# Altium schematic sheet 参考电路图.SchDoc
size 431 x 279 mm; Date: Not shown in title block; ApprovedBy: Not shown in title block; CheckedBy: Not shown in title block; Author: Not shown in title block; CompanyName: Not shown in title block; Engineer: Not shown in title block; Organization: Not shown in title block; Address1: Not shown in title block; Address2: Not shown in title block; Address3: Not shown in title block; Address4: Not shown in title block; DocumentNumber: 1; Revision: Use project parameter SCH_Rev; SheetNumber: 1; SheetTotal: 1; PageSetup: Record=PageOptions|CenterHorizontal=True|CenterVertical=True|PrintScale=0.64|XCorrection=1.00|YCorrection=1.00|PrintKind=0|BorderSize=5000000|LeftOffset=0|BottomOffset=0|Orientation=2|PaperLength=1000|PaperWidth=1000|Scale=100|PaperSource=15|PrintQuality=600|MediaType=1|DitherType=10|PaperKind=Letter|PrintScaleMode=1; CurrentTime: Not shown in title block; CurrentDate: Not shown in title block; Time: Not shown in title block; DocumentFullPathAndName: Not shown in title block; DocumentName: Not shown in title block; ModifiedDate: Not shown in title block; ImagePath: Not shown in title block
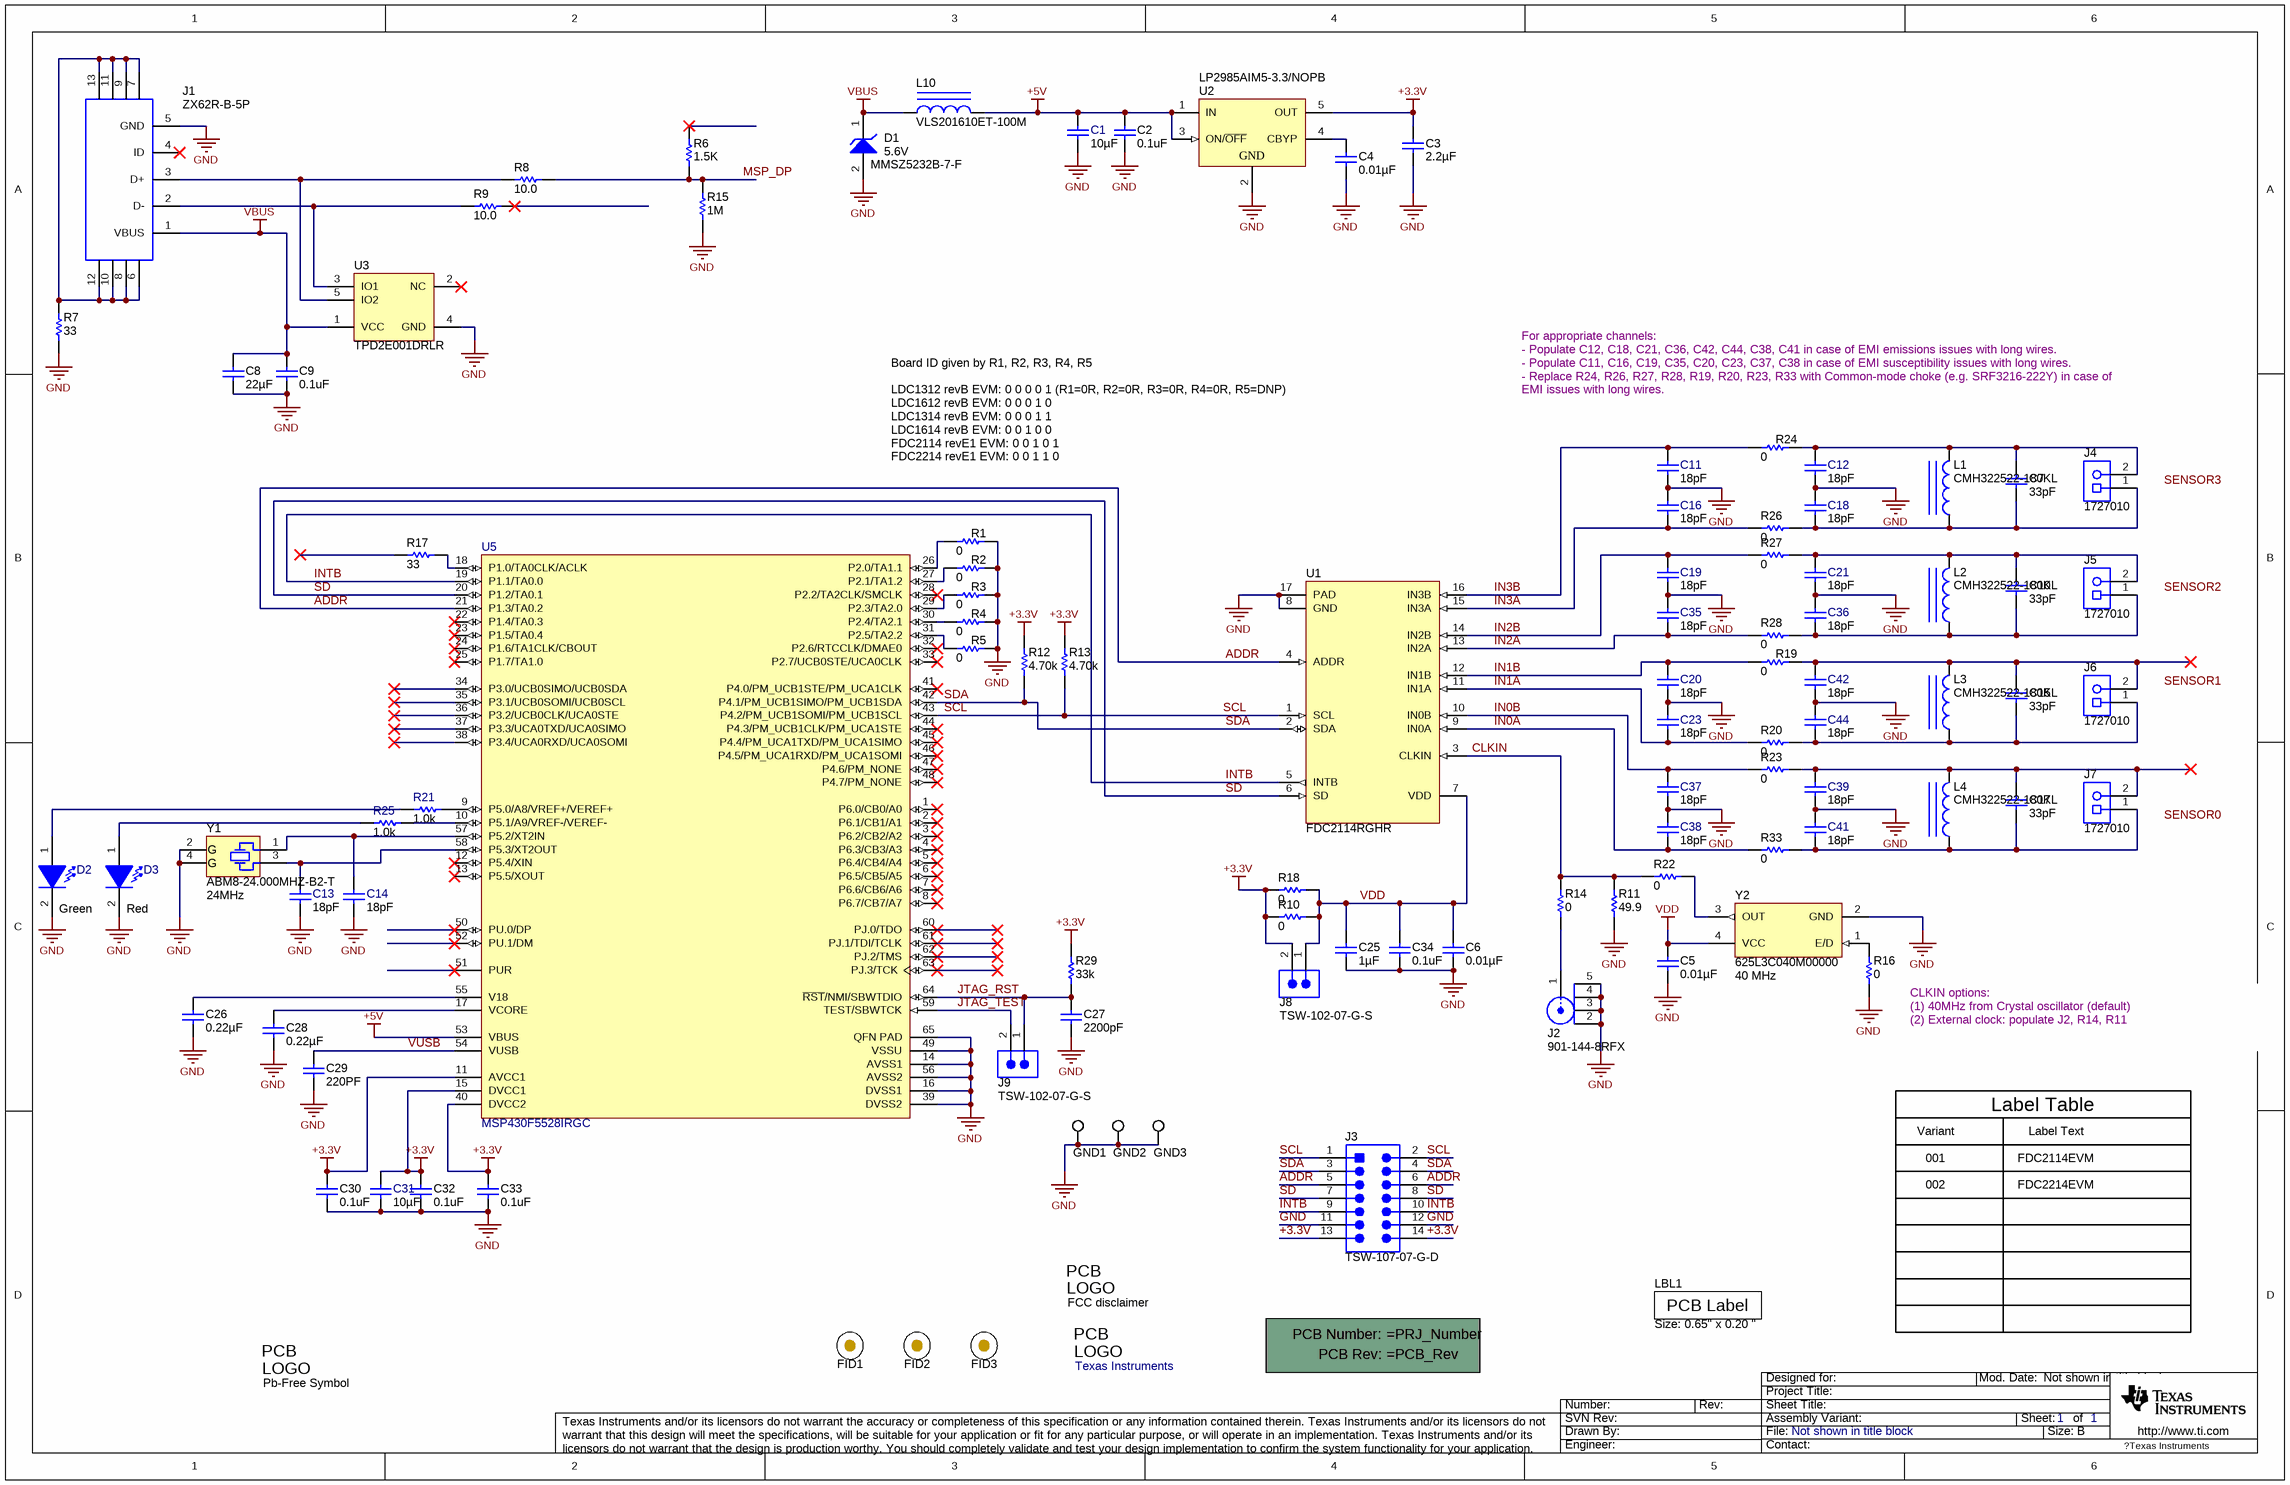
[diagram p0: 参考电路图.SchDoc]

## Parts
!PCB1  Printed Circuit Board  (value not drawn)  (mechanical)
C1  ValueDisplayed: 10µF  [0603]  (hidden comment: C1608X5R1A106M)
C2  value 0.1uF  [0402]  (hidden comment: GRM155R71C104JA88D)
C3  ValueDisplayed: 2.2µF  [0603]  (hidden comment: C0603C225K8PACTU)
C4  ValueDisplayed: 0.01µF  [0603]  (hidden comment: C1608C0G1E103J)
C5  ValueDisplayed: 0.01µF  [0603]  (hidden comment: C1608C0G1E103J)
C6  ValueDisplayed: 0.01µF  [0402]  (hidden comment: C1005X7R1C103K)
C7  ValueDisplayed: 33pF  [0603_950]  (hidden comment: CL10C330FB8NNNC)
C8  ValueDisplayed: 22µF  [0805_HV]  (hidden comment: C2012X5R1C226K125AC)
C9  value 0.1uF  [0402]  (hidden comment: GRM155R71C104JA88D)
C10  ValueDisplayed: 33pF  [0603_950]  (hidden comment: CL10C330FB8NNNC)
C11  ValueDisplayed: 18pF  [0603]  (hidden comment: GRM1885C2A180JA01D)
C12  ValueDisplayed: 18pF  [0603]  (hidden comment: GRM1885C2A180JA01D)
C13  ValueDisplayed: 18pF  [0603]  (hidden comment: GRM1885C2A180JA01D)
C14  ValueDisplayed: 18pF  [0603]  (hidden comment: GRM1885C2A180JA01D)
C15  ValueDisplayed: 33pF  [0603_950]  (hidden comment: CL10C330FB8NNNC)
C16  ValueDisplayed: 18pF  [0603]  (hidden comment: GRM1885C2A180JA01D)
C17  ValueDisplayed: 33pF  [0603_950]  (hidden comment: CL10C330FB8NNNC)
C18  ValueDisplayed: 18pF  [0603]  (hidden comment: GRM1885C2A180JA01D)
C19  ValueDisplayed: 18pF  [0603]  (hidden comment: GRM1885C2A180JA01D)
C20  ValueDisplayed: 18pF  [0603]  (hidden comment: GRM1885C2A180JA01D)
C21  ValueDisplayed: 18pF  [0603]  (hidden comment: GRM1885C2A180JA01D)
C23  ValueDisplayed: 18pF  [0603]  (hidden comment: GRM1885C2A180JA01D)
C25  ValueDisplayed: 1µF  [0402]  (hidden comment: GRM155R61A105KE15D)
C26  ValueDisplayed: 0.22µF  [0805_HV]  (hidden comment: 08053C224JAT2A)
C27  ValueDisplayed: 2200pF  [0603]  (hidden comment: C0603X222K5RACTU)
C28  ValueDisplayed: 0.22µF  [0805_HV]  (hidden comment: 08053C224JAT2A)
C29  value 220PF  [0402]  (hidden comment: C1005C0G1H221F050BA)
C30  value 0.1uF  [0402]  (hidden comment: GRM155R71C104JA88D)
C31  ValueDisplayed: 10µF  [0603]  (hidden comment: C1608X5R1A106M)
C32  value 0.1uF  [0402]  (hidden comment: GRM155R71C104JA88D)
C33  value 0.1uF  [0402]  (hidden comment: GRM155R71C104JA88D)
C34  value 0.1uF  [0402]  (hidden comment: GRM155R71C104JA88D)
C35  ValueDisplayed: 18pF  [0603]  (hidden comment: GRM1885C2A180JA01D)
C36  ValueDisplayed: 18pF  [0603]  (hidden comment: GRM1885C2A180JA01D)
C37  ValueDisplayed: 18pF  [0603]  (hidden comment: GRM1885C2A180JA01D)
C38  ValueDisplayed: 18pF  [0603]  (hidden comment: GRM1885C2A180JA01D)
C39  ValueDisplayed: 18pF  [0603]  (hidden comment: GRM1885C2A180JA01D)
C41  ValueDisplayed: 18pF  [0603]  (hidden comment: GRM1885C2A180JA01D)
C42  ValueDisplayed: 18pF  [0603]  (hidden comment: GRM1885C2A180JA01D)
C44  ValueDisplayed: 18pF  [0603]  (hidden comment: GRM1885C2A180JA01D)
D1  MMSZ5232B-7-F  value 5.6V  [SOD-123]
D2  value Green  [LG L29K_GREEN]  (hidden comment: LG L29K-G2J1-24-Z)
D3  value Red  [SML-LX0603SRW_SuperRed]  (hidden comment: SML-LX0603SRW-TR)
FID1  Fiducial  [Fiducial10-20]  (value not drawn)
FID2  Fiducial  [Fiducial10-20]  (value not drawn)
FID3  Fiducial  [Fiducial10-20]  (value not drawn)
GND1  5015  [Testpoint_Keystone_Miniature]  (value not drawn)
GND2  5015  [Testpoint_Keystone_Miniature]  (value not drawn)
GND3  5015  [Testpoint_Keystone_Miniature]  (value not drawn)
J1  ZX62R-B-5P  [Hirose_ZX62R-B-5P]
J2  901-144-8RFX  [Amphenol_901-144-8RFX]
J3  TSW-107-07-G-D  [TSW-107-07-G-D]
J4  1727010  [PhoenixConact_1727010]
J5  1727010  [PhoenixConact_1727010]
J6  1727010  [PhoenixConact_1727010]
J7  1727010  [PhoenixConact_1727010]
J8  TSW-102-07-G-S  [TSW-102-07-G-S]
J9  TSW-102-07-G-S  [TSW-102-07-G-S]
L1  CMH322522-180KL  [CMH322522]
L2  CMH322522-180KL  [CMH322522]
L3  CMH322522-180KL  [CMH322522]
L4  CMH322522-180KL  [CMH322522]
L10  VLS201610ET-100M  [VLS201610ET]
LBL1  Size: 0.65" x 0.20 "  [Label_650x200]
Logo1  Texas Instruments  [TI_Stacked_Overlay_Small]  (no BOM)
Logo2  FCC disclaimer  [FCC_disclaimer_stacked]  (no BOM)
Logo3  Pb-Free Symbol  [Pb-Free_Overlay_Medium]  (no BOM)
R1  value 0  [0603]  (hidden comment: CRCW06030000Z0EA)
R2  value 0  [0603]  (hidden comment: CRCW06030000Z0EA)
R3  value 0  [0603]  (hidden comment: CRCW06030000Z0EA)
R4  value 0  [0603]  (hidden comment: CRCW06030000Z0EA)
R5  value 0  [0603]  (hidden comment: CRCW06030000Z0EA)
R6  value 1.5K  [0402]  (hidden comment: CRCW04021K50JNED)
R7  value 33  [0603]  (hidden comment: CRCW060333R0JNEA)
R8  ValueDisplayed: 10.0  [0402]  (hidden comment: CRCW040210R0FKED)
R9  ValueDisplayed: 10.0  [0402]  (hidden comment: CRCW040210R0FKED)
R10  value 0  [0603]  (hidden comment: CRCW06030000Z0EA)
R11  ValueDisplayed: 49.9  [0603]  (hidden comment: CRCW060349R9FKEA)
R12  value 4.70k  [0603]  (hidden comment: RC0603FR-074K7L)
R13  value 4.70k  [0603]  (hidden comment: RC0603FR-074K7L)
R14  value 0  [0603]  (hidden comment: CRCW06030000Z0EA)
R15  value 1M  [0402]  (hidden comment: RC0402JR-071ML)
R16  value 0  [0603]  (hidden comment: CRCW06030000Z0EA)
R17  value 33  [0603]  (hidden comment: CRCW060333R0JNEA)
R18  value 0  [0603]  (hidden comment: CRCW06030000Z0EA)
R19  value 0  [0805_HV]  (hidden comment: CRCW08050000Z0EA)
R20  value 0  [0805_HV]  (hidden comment: CRCW08050000Z0EA)
R21  value 1.0k  [0402]  (hidden comment: CRCW04021K00JNED)
R22  value 0  [0603]  (hidden comment: CRCW06030000Z0EA)
R23  value 0  [0805_HV]  (hidden comment: CRCW08050000Z0EA)
R24  value 0  [0805_HV]  (hidden comment: CRCW08050000Z0EA)
R25  value 1.0k  [0402]  (hidden comment: CRCW04021K00JNED)
R26  value 0  [0805_HV]  (hidden comment: CRCW08050000Z0EA)
R27  value 0  [0805_HV]  (hidden comment: CRCW08050000Z0EA)
R28  value 0  [0805_HV]  (hidden comment: CRCW08050000Z0EA)
R29  value 33k  [0402]  (hidden comment: CRCW040233K0JNED)
R33  value 0  [0805_HV]  (hidden comment: CRCW08050000Z0EA)
U1  FDC2114RGHR  [RGH0016A]
U2  LP2985AIM5-3.3/NOPB  [MF05A_N]
U3  TPD2E001DRLR  [DRL0005A]
U5  MSP430F5528IRGC  [RGC0064B]
Y1  ABM8-24.000MHZ-B2-T  Frequency: 24MHz  [XTAL_ABM8]
Y2  625L3C040M00000  Frequency: 40 MHz  [OSC_CTS_625]

## Nets
+3.3V: C3.1 C30.1 C31.1 C32.1 C33.1 J3.13 J3.14 J8.2 R10.1 R12.2 R13.2 R18.1 R29.1 U2.5(OUT) U5.11(AVCC1) U5.15(DVCC1) U5.40(DVCC2)
+5V: C1.1 C2.1 L10.2 U2.1(IN) U2.3(ON/~{OFF}) U5.53(VBUS)
GND: C1.2 C2.2 C3.2 C4.2 C5.2 C6.2 C8.2 C9.2 C11.1 C12.1 C13.1 C14.1 C16.2 C18.2 C19.1 C20.1 C21.1 C23.2 C25.2 C26.2 C27.1 C28.2 C29.2 C30.2 C31.2 C32.2 C33.2 C34.2 C35.2 C36.2 C37.1 C38.2 C39.1 C41.2 C42.1 C44.2 D1.2(A) D2.2(K) D3.2(K) GND1.1 GND2.1 GND3.1 J1.5(GND) J2.2 J2.3 J2.4 J2.5 J3.11 J3.12 R1.2 R2.2 R3.2 R4.2 R5.2 R7.1 R11.1 R15.1 R16.1 U1.8(GND) U1.17(PAD) U2.2(GND) U3.4(GND) U5.14(AVSS1) U5.16(DVSS1) U5.39(DVSS2) U5.49(VSSU) U5.56(AVSS2) U5.65(QFN_PAD) Y1.2(GND) Y1.4(GND) Y2.2(GND)
VBUS: C8.1 C9.1 D1.1(K) J1.1(VBUS) L10.1 U3.1(VCC)
VDD: C5.1 C6.1 C25.1 C34.1 J8.1 R10.2 R18.2 U1.7(VDD) Y2.4(VCC)
ADDR: J3.5 J3.6 U1.4(ADDR) U5.21(P1.3/TA0.2)
CLKIN: R11.2 R14.2 R22.2 U1.3(CLKIN)
IN0A: C38.1 R33.1 U1.9(IN0A)
IN0B: C37.2 R23.1 U1.10(IN0B)
IN1A: C23.1 R20.1 U1.11(IN1A)
IN1B: C20.2 R19.1 U1.12(IN1B)
IN2A: C35.1 R28.1 U1.13(IN2A)
IN2B: C19.2 R27.1 U1.14(IN2B)
IN3A: C16.1 R26.1 U1.15(IN3A)
IN3B: C11.2 R24.1 U1.16(IN3B)
INTB: J3.9 J3.10 U1.5(INTB) U5.19(P1.1/TA0.0)
JTAG_RST: C27.2 J9.1 R29.2 U5.64(~{RST}/NMI/SBWTDIO)
JTAG_TEST: J9.2 U5.59(TEST/SBWTCK)
MSP_DP: R6.1 R8.2 R15.2
SCL: J3.1 J3.2 R13.1 U1.1(SCL) U5.43(P4.2/PM_UCB1SOMI/PM_UCB1SCL)
SD: J3.7 J3.8 U1.6(SD) U5.20(P1.2/TA0.1)
SDA: J3.3 J3.4 R12.1 U1.2(SDA) U5.42(P4.1/PM_UCB1SIMO/PM_UCB1SDA)
VUSB: C29.1 U5.54(VUSB)
NetC4_1: C4.1 U2.4(CBYP)
NetC7_1: C7.1 C12.2 J4.2 L1.2 R24.2
NetC7_2: C7.2 C18.1 J4.1 L1.1 R26.2
NetC10_1: C10.1 C21.2 J5.2 L2.2 R27.2
NetC10_2: C10.2 C36.1 J5.1 L2.1 R28.2
NetC13_2: C13.2 U5.58(P5.3/XT2OUT) Y1.3
NetC14_2: C14.2 U5.57(P5.2/XT2IN) Y1.1
NetC15_1: C15.1 C42.2 J6.2 L3.2 R19.2
NetC15_2: C15.2 C44.1 J6.1 L3.1 R20.2
NetC17_1: C17.1 C39.2 J7.2 L4.2 R23.2
NetC17_2: C17.2 C41.1 J7.1 L4.1 R33.2
NetC26_1: C26.1 U5.55(V18)
NetC28_1: C28.1 U5.17(VCORE)
NetD2_1: D2.1(A) R21.2
NetD3_1: D3.1(A) R25.2
NetJ1_2: J1.2(D-) R9.1 U3.3(IO1)
NetJ1_3: J1.3(D+) R8.1 U3.5(IO2)
NetJ1_6: J1.6 J1.7 J1.8 J1.9 J1.10 J1.11 J1.12 J1.13 R7.2
NetJ2_1: J2.1 R14.1
NetR1_1: R1.1 U5.26(P2.0/TA1.1)
NetR2_1: R2.1 U5.27(P2.1/TA1.2)
NetR3_1: R3.1 U5.29(P2.3/TA2.0)
NetR4_1: R4.1 U5.30(P2.4/TA2.1)
NetR5_1: R5.1 U5.31(P2.5/TA2.2)
NetR16_2: R16.2 Y2.1(E/D)
NetR17_1: R17.1 U5.18(P1.0/TA0CLK/ACLK)
NetR21_1: R21.1 U5.9(P5.0/A8/VREF+/VEREF+)
NetR22_1: R22.1 Y2.3(OUT)
NetR25_1: R25.1 U5.10(P5.1/A9/VREF-/VEREF-)

Not connected (* = marked no-connect by the designer): J1 4(ID)*; R6 2*; R9 2*; R17 2*; U3 2(NC)*; U5 1(P6.0/CB0/A0)* 2(P6.1/CB1/A1)* 3(P6.2/CB2/A2)* 4(P6.3/CB3/A3)* 5(P6.4/CB4/A4)* 6(P6.5/CB5/A5)* 7(P6.6/CB6/A6)* 8(P6.7/CB7/A7)* 12(P5.4/XIN)* 13(P5.5/XOUT)* 22(P1.4/TA0.3)* 23(P1.5/TA0.4)* 24(P1.6/TA1CLK/CBOUT)* 25(P1.7/TA1.0)* 28(P2.2/TA2CLK/SMCLK)* 32(P2.6/RTCCLK/DMAE0)* 33(P2.7/UCB0STE/UCA0CLK)* 34(P3.0/UCB0SIMO/UCB0SDA)* 35(P3.1/UCB0SOMI/UCB0SCL)* 36(P3.2/UCB0CLK/UCA0STE)* 37(P3.3/UCA0TXD/UCA0SIMO)* 38(P3.4/UCA0RXD/UCA0SOMI)* 41(P4.0/PM_UCB1STE/PM_UCA1CLK)* 44(P4.3/PM_UCB1CLK/PM_UCA1STE)* 45(P4.4/PM_UCA1TXD/PM_UCA1SIMO)* 46(P4.5/PM_UCA1RXD/PM_UCA1SOMI)* 47(P4.6/PM_NONE)* 48(P4.7/PM_NONE)* 50(PU.0/DP)* 51(PUR)* 52(PU.1/DM)* 60(PJ.0/TDO)* 61(PJ.1/TDI/TCLK)* 62(PJ.2/TMS)* 63(PJ.3/TCK)*

## Notes on the sheet
- For appropriate channels:
  - Populate C12, C18, C21, C36, C42, C44, C38, C41 in case of EMI emissions issues with long wires.
  - Populate C11, C16, C19, C35, C20, C23, C37, C38 in case of EMI susceptibility issues with long wires.
  - Replace R24, R26, R27, R28, R19, R20, R23, R33 with Common-mode choke (e.g. SRF3216-222Y) in case of EMI issues with long wires.
- Board ID given by R1, R2, R3, R4, R5
  LDC1312 revB EVM: 0 0 0 0 1 (R1=0R, R2=0R, R3=0R, R4=0R, R5=DNP)
  LDC1612 revB EVM: 0 0 0 1 0
  LDC1314 revB EVM: 0 0 0 1 1
  LDC1614 revB EVM: 0 0 1 0 0
  FDC2114 revE1 EVM: 0 0 1 0 1
  FDC2214 revE1 EVM: 0 0 1 1 0
- (near R16) CLKIN options:
  (1) 40MHz from Crystal oscillator (default)
  (2) External clock: populate J2, R14, R11
- Label Table
- Variant
- 001
- Label Text
- FDC2114EVM
- 002
- FDC2214EVM
- Labels drawn without touching a wire or pin: SENSOR0, SENSOR1, SENSOR2, SENSOR3
- Drawn By:
- SVN Rev:
- Number:
- Rev:
- Sheet Title:
- File:
- Project Title:
- Designed for:
- Assembly Variant:
- Mod. Date:
- Sheet:
- Size:
- of
- B
- http://www.ti.com
- Texas Instruments and/or its licensors do not warrant the accuracy or completeness of this specification or any information contained therein. Texas Instruments and/or its licensors do not warrant that this design will meet the specifications, will be suitable for your application or fit for any particular purpose, or will operate in an implementation. Texas Instruments and/or its licensors do not warrant that the design is production worthy. You should completely validate and test your design implementation to confirm the system functionality for your application.
- Engineer:
- Contact:
- ?Texas Instruments
- (in symbol ABM8-24.000MHZ-B2-T) G
- (in symbol FCC_disclaimer) PCB; LOGO
- (in symbol Pb-Free) PCB; LOGO
- (in symbol PCB) PCB Number:; PCB Rev:
- (in symbol THT-14-423-10) PCB Label
- (in symbol TI_Logo) PCB; LOGO

## Library data of the parts
!PCB1 = PCB: Manufacturer: Any; SymbolCreator: a0412235; SymbolVersion: 2012-05-30; CompType: PCB; PartNumber: =PRJ_Number; RoHS: O; MountType: N/A; Publisher: Texas Instruments; LatestRevisionDate: 2012-06-27; LatestRevisionNote: Initial Version; Alternate Manufacturer: -; Alternate PartNumber: -
C1 C31 = C1608X5R1A106M: CAP, CERM, 10uF, 10V, +/-20%, X5R, 0603; Manufacturer: TDK; Polarized: N; CompType: Capacitor; U/M: EA; Cap_F: 0.00001; Tolerance_%: 20; ESR_Ohm: 0.0078; Value1: 0.0078 ohm; VDC_V: 10; IRMS_A: 1.85; TaMin_C: -55; TaMax_C: 85; SymbolVersion: 2008-07-09; Value: 10uF; PartNumber: C1608X5R1A106M; PackageReference: 0603; RoHS: Y; Value2: 10V; MountType: SMT; Technology: Ceramic; TempCo: X5R; Cap_Case: 0603; Published: 2008-06-19; Publisher: Texas Instruments; LatestRevisionDate: 2014-03-28; ComponentLink1Description: Datasheet link; ComponentLink1URL: http://www.tdk.com/pdf/general_B11.pdf; Supplier 1: Digi-Key; Supplier Part Number 1: 445-6853-1-ND; Supplier 2: Farnell; Supplier Part Number 2: 1962113
C2 C9 C30 C32-C34 = 0402YC132KAT2A: CAP CER 0.1UF 16V 5% X7R 0402; Manufacturer: Murata Electronics North America; Polarized: N; CompType: Capacitor; U/M: EA; Cap_F: 0.0000000013; Tolerance_%: 10; VDC_V: 16; TaMin_C: -55; TaMax_C: 125; SymbolVersion: 2008-07-09; PartNumber: GRM155R71C104JA88D; PackageReference: 0402; RoHS: Y; MountType: SMT; Technology: Ceramic; TempCo: X7R; Cap_Case: 0402; Published: 2008-06-19; Publisher: Texas Instruments; LatestRevisionDate: 2013-02-06; LatestRevisionNote: Changed publisher; ComponentLink1Description: Datasheet link; ComponentLink1URL: https://www.avx.com/docs/catalogs/cx7r.pdf; Supplier 1: Digi-Key; Supplier Part Number 1: 0402YC132KAT2A-ND
C3 = C0603C225K8PACTU: CAP, CERM, 2.2uF, 10V, +/-10%, X5R, 0603; Manufacturer: Kemet; Polarized: N; CompType: Capacitor; U/M: EA; Cap_F: 0.0000022; Tolerance_%: 10; Value1: Unknown; TaMin_C: -55; TaMax_C: 85; SymbolVersion: 2008-07-09; Value: 2.2uF; PartNumber: C0603C225K8PACTU; PackageReference: 0603; RoHS: Y; VDC_V: 10; Value2: 10V; MountType: SMT; Technology: Ceramic; TempCo: X5R; Cap_Case: 0603; Published: 2008-06-19; Publisher: Texas Instruments; LatestRevisionDate: 2013-02-06; LatestRevisionNote: Changed publisher; ComponentLink1Description: Datasheet link; ComponentLink1URL: http://www.kemet.com/kemet/web/homepage/kechome.nsf/vapubfiles/F3102_Y5V.pdf/$file/F3102_Y5V.pdf; Supplier 1: Digi-Key; Supplier Part Number 1: 399-4911-1-ND; Supplier 2: Mouser; Supplier Part Number 2: 80-C0603C225K8P; Supplier 3: Farnell; Supplier Part Number 3: 1108322
C4 C5 = C1608C0G1E103J: CAP, CERM, 0.01uF, 25V, +/-5%, C0G/NP0, 0603; Manufacturer: TDK; Polarized: N; CompType: Capacitor; U/M: EA; Cap_F: 0.00000001; Tolerance_%: 5; VDC_V: 25; TaMin_C: -55; TaMax_C: 125; SymbolVersion: 2008-07-09; Value: 0.01uF; PartNumber: C1608C0G1E103J; PackageReference: 0603; RoHS: Y; Value1: ?; Value2: 25V; MountType: SMT; Technology: Ceramic; TempCo: C0G/NP0; Cap_Case: 0603; Published: 2008-06-19; Publisher: Texas Instruments; LatestRevisionDate: 2012-08-23; LatestRevisionNote: Changed publisher; ComponentLink1Description: Datasheet link; ComponentLink1URL: http://www.tdk.co.jp/tefe02/e412_c.pdf; Alternate PartNumber: -; Alternate Manufacturer: -; Supplier 1: Digi-Key; Supplier Part Number 1: 445-2664-1-ND; Supplier 2: Arrow; Supplier Part Number 2: C1608C0G1E103J
C6 = C1005X7R1C103K: CAP, CERM, 0.01 µF, 16 V, +/- 10%, X7R, 0402; Manufacturer: TDK; Polarized: N; CompType: Capacitor; Value: 0.01uF; U/M: EA; Cap_F: 0.00000001; Tolerance_%: 10; ESR_ohm: 0.0623; Value1: 0.0623 ohm; VDC_V: 16; Value2: 16V; TaMin_C: -55; TaMax_C: 125; SymbolVersion: 2008-07-09; PartNumber: C1005X7R1C103K; PackageReference: 0402; RoHS: Y; MountType: SMT; Technology: Ceramic; TempCo: X7R; Cap_Case: 0402; Published: 2008-06-19; Publisher: Texas Instruments; LatestRevisionDate: 2015-02-18; ComponentLink1Description: Datasheet link; ComponentLink1URL: http://www.tdk.co.jp/tefe02/e412_c.pdf; Supplier 1: Digi-Key; Supplier Part Number 1: 445-1262-1-ND; Supplier 2: Farnell; Supplier Part Number 2: 1844125
C7 C10 C15 C17 = CL10C330FB8NNNC: CAP, CERM, 33 pF, 50 V, +/- 1%, C0G/NP0, 0603_950; Manufacturer: Samsung; Polarized: N; CompType: Capacitor; Value: 33pF; U/M: EA; Cap_F: 0.000000000033; Tolerance_%: 1; Value1: Unknown; VDC_V: 50; Value2: 50V; TaMin_C: -55; TaMax_C: 125; Cap_Case: 0603; SymbolVersion: 2008-07-09; PartNumber: CL10C330FB8NNNC; PackageReference: 0603_950; RoHS: Y; MountType: SMT; Technology: Ceramic; TempCo: C0G/NP0; Published: 2008-06-19; Publisher: Texas Instruments; LatestRevisionDate: 2015-03-17; ComponentLink1Description: Datasheet link; ComponentLink1URL: http://www.samsungsem.com/kr/front/downloadcms.do?path=/kr/support/product-search/mlcc/__icsFiles/afieldfile/2014/11/05&fileName=S_CL10C330FB8NNNC.pdf; Supplier 1: Digi-Key; Supplier Part Number 1: 1276-2262-1-ND
C8 = C2012X5R1C226K125AC: CAP, CERM, 22uF, 16V, +/-10%, X5R, 0805; Manufacturer: TDK; Polarized: N; CompType: Capacitor; U/M: EA; Cap_F: 0.000022; Tolerance_%: 10; Value1: Unknown; VDC_V: 16; TaMin_C: -55; TaMax_C: 85; Cap_Case: 0805; SymbolVersion: 2008-07-09; Value: 22uF; PartNumber: C2012X5R1C226K125AC; PackageReference: 0805; RoHS: Y; Value2: 16V; MountType: SMT; Technology: Ceramic; TempCo: X5R; Published: 2008-06-19; Publisher: Texas Instruments; LatestRevisionDate: 2014-04-18; ComponentLink1Description: Datasheet link; ComponentLink1URL: http://product.tdk.com/capacitor/mlcc/en/documents/C2012X5R1C226K125AC.pdf; Supplier 1: Digi-Key; Supplier Part Number 1: 445-6797-1-ND; Supplier 2: Mouser; Supplier Part Number 2: 810-C2012X5R1C226K; Supplier 3: Farnell; Supplier Part Number 3: 2346925
C11-C14 C16 C18-C21 C23 C35-C39 C41 C42 C44 = GRM1885C2A180JA01D: CAP, CERM, 18pF, 100V, +/-5%, C0G/NP0, 0603; Manufacturer: MuRata; Polarized: N; CompType: Capacitor; U/M: EA; Cap_F: 0.000000000018; Tolerance_%: 5; Value1: Unknown; VDC_V: 100; TaMin_C: -55; TaMax_C: 125; SymbolVersion: 2008-07-09; Value: 18pF; PartNumber: GRM1885C2A180JA01D; PackageReference: 0603; RoHS: Y; Value2: 100V; MountType: SMT; Technology: Ceramic; TempCo: C0G/NP0; Cap_Case: 0603; Published: 2008-06-19; Publisher: Texas Instruments; LatestRevisionDate: 2014-04-03; ComponentLink1Description: Datasheet link; ComponentLink1URL: http://search.murata.co.jp/Ceramy/PnsearchViewAction.do?HnOFG=ON&HnNFG=ON&SEL_CNT=50&sLang=en&sKey=GRM1885C2A180JA01D&x=9&y=9&search=startwith; Supplier 1: Digi-Key; Supplier Part Number 1: 490-1333-1-ND; Supplier 2: Mouser; Supplier Part Number 2: 81-GRM1885C2A180JA01
C25 = GRM155R61A105KE15D: CAP, CERM, 1uF, 10V, +/-10%, X5R, 0402; Manufacturer: MuRata; Polarized: N; CompType: Capacitor; U/M: EA; Cap_F: 0.000001; Tolerance_%: 10; Value1: Unknown; TaMin_C: -55; TaMax_C: 85; SymbolVersion: 2008-07-09; Value: 1uF; PartNumber: GRM155R61A105KE15D; PackageReference: 0402; RoHS: Y; VDC_V: 10; Value2: 10V; MountType: SMT; Technology: Ceramic; TempCo: X5R; Cap_Case: 0402; Published: 2008-06-19; Publisher: Texas Instruments; LatestRevisionDate: 2013-02-06; LatestRevisionNote: Changed publisher; ComponentLink1Description: Datasheet link; ComponentLink1URL: http://search.murata.co.jp/Ceramy/PnsearchViewAction.do?HnOFG=ON&HnNFG=ON&SEL_CNT=50&sLang=en&sKey=GRM155R61A105KE15D&x=9&y=9&search=startwith; Supplier 1: Digi-Key; Supplier Part Number 1: 490-3890-1-ND; Supplier 2: Mouser; Supplier Part Number 2: 81-GRM155R61A105KE15; Supplier 3: Farnell; Supplier Part Number 3: 1735523
C26 C28 = 08053C224JAT2A: CAP, CERM, 0.22 µF, 25 V, +/- 5%, X7R, 0805; Manufacturer: AVX; Polarized: N; CompType: Capacitor; Value: 0.22uF; U/M: EA; Cap_F: 0.00000022; Tolerance_%: 5; ESR_ohm: 0.016; Value1: 0.016 ohm; VDC_V: 25; Value2: 25V; TaMin_C: -55; TaMax_C: 125; Cap_Case: 0805; SymbolVersion: 2008-07-09; PartNumber: 08053C224JAT2A; PackageReference: 0805; RoHS: Y; MountType: SMT; Technology: Ceramic; TempCo: X7R; Published: 2008-06-19; Publisher: Texas Instruments; LatestRevisionDate: 2015-03-12; ComponentLink1Description: Datasheet link; ComponentLink1URL: http://www.avx.com/docs/masterpubs/smccp.pdf; Supplier 1: Digi-Key; Supplier Part Number 1: 478-3756-1-ND; Supplier 2: Mouser; Supplier Part Number 2: 581-08053C224JAT2A; Supplier 3: Farnell; Supplier Part Number 3: 1740667
C27 = C0603X222K5RACTU: CAP, CERM, 2200pF, 50V, +/-10%, X7R, 0603; Manufacturer: Kemet; Polarized: N; CompType: Capacitor; U/M: EA; Cap_F: 0.0000000022; Tolerance_%: 10; VDC_V: 50; TaMin_C: -55; TaMax_C: 125; SymbolVersion: 2008-07-09; Value: 2200pF; PartNumber: C0603X222K5RACTU; PackageReference: 0603; RoHS: Y; Value1: ?; Value2: 50V; MountType: SMT; Technology: Ceramic; TempCo: X7R; Cap_Case: 0603; Published: 2008-06-19; Publisher: National Semiconductor; LatestRevisionDate: 2011-09-19; LatestRevisionNote: Removed DigiKeyPartNumber parameter.; ComponentLink1Description: Datasheet link; ComponentLink1URL: http://www.kemet.com/kemet/web/homepage/kechome.nsf/vapubfiles/F3102_Y5V.pdf/$file/F3102_Y5V.pdf; Alternate PartNumber: -; Alternate Manufacturer: -; Supplier 1: Digi-Key; Supplier Part Number 1: 399-5341-1-ND
C29 = 0402YC132KAT2A: CAP CER 220PF 50V 1% NP0 0402; Manufacturer: TDK Corporation; Polarized: N; CompType: Capacitor; U/M: EA; Cap_F: 0.0000000013; Tolerance_%: 10; VDC_V: 16; TempCo: X7R; TaMin_C: -55; TaMax_C: 125; SymbolVersion: 2008-07-09; PartNumber: C1005C0G1H221F050BA; PackageReference: 0402; RoHS: Y; MountType: SMT; Technology: Ceramic; Cap_Case: 0402; Published: 2008-06-19; Publisher: Texas Instruments; LatestRevisionDate: 2013-02-06; LatestRevisionNote: Changed publisher; ComponentLink1Description: Datasheet link; ComponentLink1URL: https://www.avx.com/docs/catalogs/cx7r.pdf; Supplier 1: Digi-Key; Supplier Part Number 1: 0402YC132KAT2A-ND
D1 = MMSZ5232B-7-F: Diode, Zener, 5.6V, 500mW, SOD-123; Manufacturer: Diodes Inc.; U/M: EA; Power_W: 0.5; Vz_V: 5.6; Value1: 0.5W; RJA_CperW: 350; CompType: Zener; SymbolVersion: 2010-08-25; PartNumber: MMSZ5232B-7-F; PackageReference: SOD-123; Vr_V: N/A; MountType: SMT; RoHS: Y; ComponentLink1Description: Datasheet link; ComponentLink1URL: http://www.diodes.com/datasheets/ds18010.pdf; Published: 2008-10-08; Publisher: Texas Instruments; LatestRevisionDate: 2012-01-16; LatestRevisionNote: Added TVS diodes; Alternate Manufacturer: -; Alternate PartNumber: -; Supplier 1: Digi-Key; Supplier Part Number 1: MMSZ5232B-FDICT-ND; Supplier 2: Arrow; Supplier Part Number 2: MMSZ5232B-7-F
D2 = LG L29K-G2J1-24-Z: LED, Green, SMD; Manufacturer: OSRAM; Vf_V: 1.7; Value2: 1.7V; Io_A: 0.002; Tjmax_C: 110; Value1: W; U/M: EA; CompType: LED; PartNumber: LG L29K-G2J1-24-Z; SymbolVersion: 2008-12-08; MountType: SMT; RoHS: Y; PackageReference: 1.7x0.65x0.8mm; Type: ?; Color: green; Published: 2008-07-11; Publisher: Texas Instruments; ComponentLink1URL: http://www.osram-os.com/Graphics/XPic2/00077107_0.pdf; ComponentLink1Description: Datasheet link; LatestRevisionDate: 2014-04-05; Supplier 1: Digi-Key; Supplier Part Number 1: 475-2709-1-ND; Supplier 2: Mouser; Supplier Part Number 2: 720-LGL29KG2J124Z
D3 = SML-LX0603SRW-TR: LED, Super Red, SMD; Manufacturer: Lumex; Vf_V: 1.7; Value2: 1.7V; Io_A: 0.02; Value1: W; U/M: EA; CompType: LED; PartNumber: SML-LX0603SRW-TR; SymbolVersion: 2008-12-08; MountType: SMT; RoHS: Y; PackageReference: LED, 1.6x.6x.8mm; Type: ?; Color: super red; Published: 2008-07-11; Publisher: Texas Instruments; ComponentLink1URL: http://www.lumex.com/specs/SML-LX0603SRW-TR.pdf; ComponentLink1Description: Datasheet link; LatestRevisionDate: 2014-04-10; Supplier 1: Digi-Key; Supplier Part Number 1: 67-1551-1-ND; Supplier 2: Mouser; Supplier Part Number 2: 696-SML-LX0603SRW; Supplier 3: Farnell; Supplier Part Number 3: 7608226
FID1-FID3 = Fiducial: Fiducial mark.  There is nothing to buy or mount.; SymbolCreator: codlsc; SymbolVersion: 2009-11-4; CompType: Fiducial; Publisher: National Semiconductor; LatestRevisionDate: 2011-09-19; LatestRevisionNote: Added Alternate PartNumber and Alternate Manufacturer parameters to appropriate components.; ComponentLink1URL: Paste URL for datasheet here; Manufacturer: N/A; MountType: N/A; PackageReference: Fiducial; PartNumber: N/A; ClassName: FiducialMark
GND1-GND3 = 5015: Test Point, Miniature, SMT; Manufacturer: Keystone; CompType: Test Point Loop; U/M: EA; SymbolVersion: 2008-07-10; PartNumber: 5015; Value: SMT; PackageReference: Testpoint_Keystone_Miniature; RoHS: Y; MountType: SMT; ComponentLink1Description: Datasheet Link; ComponentLink1URL: http://www.keyelco.com/userAssets/store/files/5015.PDF; Publisher: Texas Instruments; LatestRevisionDate: 2014-09-23; Supplier 1: Digi-Key; Supplier Part Number 1: 5015KCT-ND
J1 = ZX62R-B-5P: Connector, Receptacle, Micro-USB Type B, SMT; Manufacturer: Hirose Electric Co. Ltd.; SymbolCreator: a0799628; U/M: EA; SymbolVersion: 2014-05-13; PartNumber: ZX62R-B-5P; PackageReference: Connector USB Mini B; CompType: Receptacle; RoHS: Y; MountType: SMT; ComponentLink1Description: Datasheet Link; ComponentLink1URL: http://www.hirose.co.jp/cataloge_hp/e24200011.pdf; Publisher: Texas Instruments; LatestRevisionDate: 2014-06-24; Supplier 1: Digi-Key; Supplier Part Number 1: H11574CT-ND; Supplier 2: Mouser; Supplier Part Number 2: 798-ZX62R-B-5P; Supplier 3: Farnell; Supplier Part Number 3: 2300439
J2 = 901-144-8RFX: SMA Straight Jack, Gold, 50 Ohm, TH; Manufacturer: Amphenol RF; SymbolCreator: X0208326; U/M: EA; SymbolVersion: 2012-12-24; PartNumber: 901-144-8RFX; PackageReference: SMA Straight Jack, TH; CompType: JACK; RoHS: Y; MountType: TH; ComponentLink1Description: Datasheet Link; ComponentLink1URL: http://www.amphenolinfocom.eu/NavData/Drawings/C901-144-8RFX.pdf; Publisher: Texas Instruments; LatestRevisionDate: 2015-02-17; Supplier 1: Digi-Key; Supplier Part Number 1: ARFX1231-ND; Supplier 2: Mouser; Supplier Part Number 2: 523-901-144-8RFX; Supplier 3: Farnell; Supplier Part Number 3: 1339820
J3 = TSW-107-07-G-D: Header, 100mil, 7x2, Gold, TH; Manufacturer: Samtec; SymbolCreator: a0412235; U/M: EA; SymbolVersion: 2013-12-22; PartNumber: TSW-107-07-G-D; PackageReference: 7x2 Header; ClassName: Header; CompType: Header; RoHS: Y; MountType: TH; ComponentLink1Description: Datasheet Link; ComponentLink1URL: http://samtec.com/ftppub/pdf/TSW_TH.PDF; Publisher: Texas Instruments; LatestRevisionDate: 2015-02-04; Supplier 1: Digi-Key; Supplier Part Number 1: SAM1028-07-ND
J4-J7 = 1727010: Conn Term Block, 2POS, 3.81mm, TH; Manufacturer: Phoenix Contact; SymbolCreator: a0412235; CompType: Terminal Block; U/M: EA; Value: 2x1; SymbolVersion: 2013-09-04; PartNumber: 1727010; PackageReference: 2POS Terminal Block; RoHS: Y; MountType: TH; ComponentLink1Description: Datasheet Link; ComponentLink1URL: http://eshop.phoenixcontact.com/phoenix/pdf.do?UID=1727010&general=usen; Publisher: Texas Instruments; LatestRevisionDate: 2015-02-16; Supplier 1: Digi-Key; Supplier Part Number 1: 277-1947-ND
J8 J9 = TSW-102-07-G-S: Header, TH, 100mil, 2x1, Gold plated, 230 mil above insulator; Manufacturer: Samtec, Inc.; SymbolCreator: a0412235; U/M: EA; SymbolVersion: 2013-03-14; PartNumber: TSW-102-07-G-S; ClassName: Header; CompType: Header; RoHS: Y; PackageReference: TSW-102-07-G-S; MountType: TH; ComponentLink1Description: Datasheet Link; ComponentLink1URL: http://samtec.com/ftppub/pdf/TSW_TH.PDF; Publisher: Texas Instruments; LatestRevisionDate: 2013-04-23; Supplier 1: Digi-Key; Supplier Part Number 1: SAM1029-02-ND
L1-L4 = CMH322522-180KL: Inductor, Shielded, Ferrite, 18 µH, 0.12 A, 3.3 ohm, SMD; Manufacturer: Bourns; Value: 18uH; Ind_H: 18.0E-6; ValueDisplayed: 18µH; Imax_A: 0.12; Irms: 0.12A @ 20C rise; DCR_ohm: 3.3; Value1: 3.3 ohm; Value2: 0.12A; SymbolVersion: 2008-07-23; CompType: Inductor; PartNumber: CMH322522-180KL; Technology: Shielded; MountType: SMT; Material: Ferrite; PackageReference: 3.2x2.2x2.5mm; Published: 2008-06-26; Publisher: Texas Instruments; LatestRevisionDate: 2015-04-21; ComponentLink1Description: Datasheet link; ComponentLink1URL: http://www.bourns.com/data/global/pdfs/CMH322522.pdf; RoHS: Y; Supplier 1: Digi-Key; Supplier Part Number 1: CMH322522-180KLCT-ND; Supplier 2: Mouser; Supplier Part Number 2: 652-CMH322522-180KL
L10 = VLS201610ET-100M: Inductor, Shielded, Ferrite, 10 µH, 0.4 A, 1.38 ohm, SMD; Manufacturer: TDK; Value: 10uH; Ind_H: 10.0E-6; ValueDisplayed: 10µH; Imax_A: 0.4; Irms: 0.42A @ 40C rise; Isat: 0.4A @ 30% inductance drop; DCR_ohm: 1.38; Value2: 0.4A; SymbolVersion: 2008-07-23; CompType: Inductor; PartNumber: VLS201610ET-100M; Value1: 1.38 ohm; Technology: Shielded; MountType: SMT; Material: Ferrite; PackageReference: 2.0x0.95x1.6mm; Published: 2008-06-26; Publisher: Texas Instruments; LatestRevisionDate: 2015-01-12; ComponentLink1Description: Datasheet link; ComponentLink1URL: http://product.tdk.com/inductor/ind/en/documents/inductor_commercial_power_vls_en.pdf; RoHS: Y; Supplier 1: Digi-Key; Supplier Part Number 1: 445-6608-1-ND; Supplier 2: Mouser; Supplier Part Number 2: 810-VLS201610ET-100M
LBL1 = THT-14-423-10: Thermal Transfer Printable Labels, 0.650" W x 0.200" H - 10,000 per roll; Manufacturer: Brady; SymbolCreator: a0412235; CompType: Label; SymbolVersion: 2012-06-12; ClassName: Label; PartNumber: THT-14-423-10; RoHS: Y; PackageReference: PCB Label 0.650"H x 0.200"W; MountType: N/A; ComponentLink1Description: Web Page; ComponentLink1URL: http://www.bradyid.com/bradyid/pdpv/THT-14-423-10.html; Note: Size: 0.65" x 0.20 "; Publisher: Texas Instruments; LatestRevisionDate: 2012-07-31; LatestRevisionNote: Initial Version; Alternate Manufacturer: -; Alternate PartNumber: -; Supplier 1: Farnell; Supplier Part Number 1: 2065596; Supplier 2: Newark; Supplier Part Number 2: 97C5133
Logo1 = TI_Logo: Texas Instrument Corporate Signature; SymbolCreator: codlsc; SymbolVersion: 2011-08-22; ClassName: Logo; Published: 2009-03-03; Publisher: Texas Instruments; LatestRevisionDate: 2012-05-17; LatestRevisionNote: Changed publisher
Logo2 = FCC_disclaimer: SymbolCreator: codlsc; SymbolVersion: 2011-08-22; Published: 2009-03-03; Publisher: Texas Instruments; LatestRevisionDate: 2014-11-20
Logo3 = Pb-Free: SymbolCreator: a0412235; SymbolVersion: 2011-08-22; Published: 2009-03-03; Publisher: Texas Instruments; LatestRevisionDate: 2014-11-20
R1-R5 R10 R14 R16 R18 R22 = CRCW06030000Z0EA: RES, 0 ohm, 5%, 0.1W, 0603; Manufacturer: Vishay-Dale; CompType: Resistor; Value_Code: 0000; Tolerance_%: 5; Power_W: 0.1; VDC_V: 75; TempCo: 200 ppm/C; EIA_Code: E24; U/M: EA; SymbolVersion: 2009-05-29; PartNumber: CRCW06030000Z0EA; PackageReference: 0603; RoHS: Y; Res_ohm: 0; Value1: 5%; Value2: 0.1W; MountType: SMT; Technology: Thick Film; Published: 2008-06-26; Publisher: Texas Instruments; LatestRevisionDate: 2013-01-08; ComponentLink1Description: Datasheet link; ComponentLink1URL: http://www.vishay.com/docs/20035/dcrcwe3.pdf; Supplier 1: Digi-Key; Supplier Part Number 1: 541-0.0GCT-ND; Supplier 2: Mouser; Supplier Part Number 2: 71-CRCW0603-0-E3; Supplier 3: Farnell; Supplier Part Number 3: 1469739
R6 = CRCW040233K0JNED: RES 1.5K OHM 1/16W 5% 0402 SMD; Manufacturer: Vishay Dale; CompType: Resistor; Res_ohm: 33000; Value_Code: 33k0; Tolerance_%: 5; Power_W: 0.063; Value2: 0.063W; VDC_V: 50; TempCo: 200 ppm/C; EIA_Code: E24; U/M: EA; SymbolVersion: 2009-05-29; PartNumber: CRCW04021K50JNED; PackageReference: 0402; RoHS: Y; Value1: 5%; MountType: SMT; Technology: Thick Film; Published: 2008-06-26; Publisher: National Semiconductor; LatestRevisionDate: 2011-09-19; LatestRevisionNote: Removed DigiKeyPartNumber parameter.; ComponentLink1Description: Datasheet link; ComponentLink1URL: http://www.vishay.com/docs/20035/dcrcwe3.pdf; Alternate PartNumber: -; Alternate Manufacturer: -; Supplier 1: Digi-Key; Supplier 2: Farnell; Supplier 3: Newark
R7 R17 = CRCW060333R0JNEA: RES, 33 ohm, 5%, 0.1W, 0603; Manufacturer: Vishay-Dale; CompType: Resistor; Value_Code: 33R0; Tolerance_%: 5; Power_W: 0.1; VDC_V: 75; TempCo: 200 ppm/C; EIA_Code: E24; U/M: EA; SymbolVersion: 2009-05-29; PartNumber: CRCW060333R0JNEA; PackageReference: 0603; RoHS: Y; Res_ohm: 33; Value1: 5%; Value2: 0.1W; MountType: SMT; Technology: Thick Film; Published: 2008-06-26; Publisher: Texas Instruments; LatestRevisionDate: 2013-10-22; ComponentLink1Description: Datasheet link; ComponentLink1URL: http://www.vishay.com/docs/20035/dcrcwe3.pdf; Supplier 1: Digi-Key; Supplier Part Number 1: 541-33GCT-ND; Supplier 2: Mouser; Supplier Part Number 2: 71-CRCW0603J-33-E3; Supplier 3: Farnell; Supplier Part Number 3: 1692524
R8 R9 = CRCW040210R0FKED: RES, 10.0, 1%, 0.063 W, 0402; Manufacturer: Vishay-Dale; CompType: Resistor; Value: 10.0; Res_ohm: 10; Value_Code: 10R0; Tolerance_%: 1; Power_W: 0.063; Value2: 0.063W; VDC_V: 50; TempCo: 100 ppm/C; EIA_Code: E96; U/M: EA; SymbolVersion: 2009-05-29; PartNumber: CRCW040210R0FKED; PackageReference: 0402; RoHS: Y; Value1: 1%; MountType: SMT; Technology: Thick Film; Published: 2008-06-26; Publisher: Texas Instruments; LatestRevisionDate: 2014-09-20; ComponentLink1Description: Datasheet link; ComponentLink1URL: http://www.vishay.com/docs/20035/dcrcwe3.pdf; Supplier 1: Digi-Key; Supplier Part Number 1: 541-10.0LCT-ND; Supplier 2: Mouser; Supplier Part Number 2: 71-CRCW0402-10-E3; Supplier 3: Farnell; Supplier Part Number 3: 9238999
R11 = CRCW060349R9FKEA: RES, 49.9, 1%, 0.1 W, 0603; Manufacturer: Vishay-Dale; CompType: Resistor; Value: 49.9; Value_Code: 49R9; Tolerance_%: 1; Power_W: 0.1; Value2: 0.1W; VDC_V: 75; TempCo: 100 ppm/C; EIA_Code: E96; U/M: EA; SymbolVersion: 2009-05-29; PartNumber: CRCW060349R9FKEA; PackageReference: 0603; RoHS: Y; Res_ohm: 49.9; Value1: 1%; MountType: SMT; Technology: Thick Film; Published: 2008-06-26; Publisher: Texas Instruments; LatestRevisionDate: 2015-03-06; ComponentLink1Description: Datasheet link; ComponentLink1URL: http://www.vishay.com/docs/20035/dcrcwe3.pdf; Supplier 1: Digi-Key; Supplier Part Number 1: 541-49.9HCT-ND; Supplier 2: Mouser; Supplier Part Number 2: 71-CRCW0603-49.9-E3; Supplier 3: Farnell; Supplier Part Number 3: 1469817
R12 R13 = RC0603FR-074K7L: RES, 4.70k ohm, 1%, 0.1W, 0603; Manufacturer: Yageo America; CompType: Resistor; Res_ohm: 4700; Value_Code: 4k70; Tolerance_%: 1; Power_W: 0.1; VDC_V: 150; TempCo: 200 ppm/C; U/M: EA; SymbolVersion: 2009-05-29; PartNumber: RC0603FR-074K7L; PackageReference: 0603; RoHS: Y; Value1: 1%; Value2: 0.1W; MountType: SMT; Technology: Thick Film; Published: 2008-06-26; Publisher: Texas Instruments; LatestRevisionDate: 2014-04-18; ComponentLink1Description: Datasheet link; ComponentLink1URL: http://www.yageo.com/pdf/Pu-RC0603_51_PbFree_L_2.pdf; Supplier 1: Digi-Key; Supplier Part Number 1: 311-4.70KHRCT-ND; Supplier 2: Mouser; Supplier Part Number 2: 603-RC0603FR-074K7L; Supplier 3: Farnell; Supplier Part Number 3: 9238565
R15 = CRCW040233K0JNED: RES,1M ohm, 5%, 0.063W, 0402; Manufacturer: Yageo; CompType: Resistor; Res_ohm: 33000; Value_Code: 33k0; Tolerance_%: 5; Power_W: 0.063; VDC_V: 50; TempCo: 200 ppm/C; EIA_Code: E24; U/M: EA; SymbolVersion: 2009-05-29; PartNumber: RC0402JR-071ML; PackageReference: 0402; RoHS: Y; Value1: 5%; Value2: 0.063W; MountType: SMT; Technology: Thick Film; Published: 2008-06-26; Publisher: National Semiconductor; LatestRevisionDate: 2011-09-19; LatestRevisionNote: Removed DigiKeyPartNumber parameter.; ComponentLink1Description: Datasheet link; ComponentLink1URL: http://www.vishay.com/docs/20035/dcrcwe3.pdf; Alternate PartNumber: -; Alternate Manufacturer: -; Supplier 1: Digi-Key; Supplier 2: Farnell; Supplier 3: Newark
R19 R20 R23 R24 R26-R28 R33 = CRCW08050000Z0EA: RES, 0 ohm, 5%, 0.125W, 0805; Manufacturer: Vishay-Dale; CompType: Resistor; Value_Code: 0000; Tolerance_%: 5; Power_W: 0.125; VDC_V: 150; TempCo: 200 ppm/C; EIA_Code: E24; U/M: EA; SymbolVersion: 2009-05-29; PartNumber: CRCW08050000Z0EA; PackageReference: 0805; RoHS: Y; Res_ohm: 0; Value1: 5%; Value2: 0.125W; MountType: SMT; Technology: Thick Film; Published: 2008-06-26; Publisher: Texas Instruments; LatestRevisionDate: 2014-04-18; ComponentLink1Description: Datasheet link; ComponentLink1URL: http://www.vishay.com/docs/20035/dcrcwe3.pdf; Supplier 1: Digi-Key; Supplier Part Number 1: 541-0.0ACT-ND; Supplier 2: Mouser; Supplier Part Number 2: 71-CRCW0805-0-E3; Supplier 3: Farnell; Supplier Part Number 3: 1469846
R21 R25 = CRCW04021K00JNED: RES, 1.0k ohm, 5%, 0.063W, 0402; Manufacturer: Vishay-Dale; CompType: Resistor; Res_ohm: 1000; Value_Code: 1k00; Tolerance_%: 5; Power_W: 0.063; VDC_V: 50; TempCo: 200 ppm/C; EIA_Code: E24; U/M: EA; SymbolVersion: 2009-05-29; PartNumber: CRCW04021K00JNED; PackageReference: 0402; RoHS: Y; Value1: 5%; Value2: 0.063W; MountType: SMT; Technology: Thick Film; Published: 2008-06-26; Publisher: Texas Instruments; LatestRevisionDate: 2013-11-01; ComponentLink1Description: Datasheet link; ComponentLink1URL: http://www.vishay.com/docs/20035/dcrcwe3.pdf; Supplier 1: Mouser; Supplier Part Number 1: 71-CRCW0402J-1.0K-E3; Supplier 2: Farnell; Supplier Part Number 2: 1514656; Supplier 3: Newark; Supplier Part Number 3: 59M6691
R29 = CRCW040233K0JNED: RES, 33k ohm, 5%, 0.063W, 0402; Manufacturer: Vishay-Dale; CompType: Resistor; Res_ohm: 33000; Value_Code: 33k0; Tolerance_%: 5; Power_W: 0.063; VDC_V: 50; TempCo: 200 ppm/C; EIA_Code: E24; U/M: EA; SymbolVersion: 2009-05-29; PartNumber: CRCW040233K0JNED; PackageReference: 0402; RoHS: Y; Value1: 5%; Value2: 0.063W; MountType: SMT; Technology: Thick Film; Published: 2008-06-26; Publisher: National Semiconductor; LatestRevisionDate: 2011-09-19; LatestRevisionNote: Removed DigiKeyPartNumber parameter.; ComponentLink1Description: Datasheet link; ComponentLink1URL: http://www.vishay.com/docs/20035/dcrcwe3.pdf; Alternate PartNumber: -; Alternate Manufacturer: -; Supplier 1: Digi-Key; Supplier Part Number 1: 541-33KJCT-ND; Supplier 2: Farnell; Supplier Part Number 2: 1514697; Supplier 3: Newark; Supplier Part Number 3: 59M6727
U1 = FDC2114RGHR: Multi-Channel 12/26-Bit Capacitance to Digital Converter (FDC) for Capacitive Sensing, RGH0016A; Manufacturer: Texas Instruments; SymbolCreator: a0411947; CompType: IC; U/M: EA; SymbolVersion: 2014-04-21; PartNumber: FDC2114RGHR; PackageReference: RGH0016A; MountType: SMT; ComponentLink1Description: Datasheet Link; ComponentLink1URL: https://sps06.itg.ti.com/sites/KMS/crossdivteams/altium/docs/ComponentDatasheets/2015-03-12 - FDC2112_FDC2114_SNOSCZ5.pdf; RoHS: Y; Publisher: Texas Instruments; LatestRevisionDate: 2015-03-20; Alternate Manufacturer: Texas Instruments
U2 = LP2985AIM5-3.3/NOPB: Micropower 150 mA Low-Noise Ultra Low-Dropout Regulator, 5-pin SOT-23, Pb-Free; Manufacturer: Texas Instruments; PackageTopMarking: L0RA*XTT; PowerWise: N; CompType: LDO IC; Published: 1-Mar-2010; DatasheetVersion: Jul-2007; PackageVersion: revD, Aug-2008; PackageReference: MF05A; Publisher: Altium Limited; PackageDescription: Molded SOT-23, .115 x .063 x .040 in Body, 5 Lead, .0375 in Pitch; Supplier 1: Digi-Key; Supplier Part Number 1: LP2985AIM5-3.3CT-ND; Supplier 2: Digi-Key; Supplier Part Number 2: LP2985AIM5-3.3TR-ND; Supplier 3: Digi-Key; Supplier Part Number 3: LP2985AIM5-3.3DKR-ND; Supplier 4: Farnell; Supplier Part Number 4: 1469134; PartNumber: LP2985AIM5-3.3/NOPB; RoHS: Y; PinCount: 5; ComponentLink1Description: LP2985 Datasheet; ComponentLink1URL: http://www.national.com/ds/LP/LP2985.pdf; ComponentLink2Description: LP2985 Web Page; ComponentLink2URL: http://www.national.com/pf/LP/LP2985.html; ComponentLink3Description: MF05A Package Page; ComponentLink3URL: http://www.national.com/packaging/folders/mf05a.html
U3 = TPD2E001DRLR: Low-Capacitance + / - 15 kV ESD-Protection Array for High-Speed Data Interfaces, 2 Channels, -40 to +85 degC, 5-pin SOT (DRL), Green (RoHS & no Sb/Br); Manufacturer: Texas Instruments; Alternate Manufacturer: None; Alternate PartNumber: Equivalent; Breakdown Voltage(Min)(V): 11; IEC 61000-4-2 Air-Gap(+/- kV): 15; IEC 61000-4-2 Contact(+/- kV): 8; IO Capacitance(Typ)(pF): 1.5; IO Leakage Current(nA): 1; SubFamily: ESD Solution; USB High Speed: TRUE; DatasheetVersion: SLLS684F; PackageVersion: revD, Aug-2007; PackageReference: DRL0005A; PackageDescription: 5-Pin Plastic Small Outline, Flat Lead 0.5 mm Pitch; Supplier 1: Digi-Key; Supplier Part Number 1: 296-21883-2-ND; Supplier 2: Digi-Key; Supplier Part Number 2: 296-21883-1-ND; Supplier 3: Digi-Key; Supplier Part Number 3: 296-21883-6-ND; Supplier 4: Farnell; Supplier Part Number 4: 1412055; Supplier 5: Newark; Supplier Part Number 5: 41M5840; Supplier 6: Mouser; Supplier Part Number 6: 595-TPD2E001DRLR; Eco-Plan: Green (RoHS & no Sb/Br); MountType: SMT; PartNumber: TPD2E001DRLR; ComponentLink1Description: Datasheet; ComponentLink1URL: http://www.ti.com/general/docs/lit/getliterature.tsp?genericPartNumber=TPD2E001&fileType=pdf; ComponentLink2Description: URL Link1; ComponentLink2URL: SamplesURL:http://www.ti.com/product/tpd2e001#samples
U5 = MSP430F5528IRGC: Mixed Signal MicroController, RGC0064B; Manufacturer: Texas Instruments; Alternate Manufacturer: None; ADC: 12-bit SAR; ADC Channels: 16; Brown Out Reset: Yes; DMA: 3; Eco-Plan: Green (RoHS & no Sb/Br); Flash(KB): 128; Frequency(MHz): 25; GPIO: 47; Multiplier: 32x32; SRAM(B): 8192; SubFamily: 5 Series; Timers - 16-bit: 4; USB: 1; USCI_A (UART/LIN/IrDA/SPI): 2; SymbolCreator: Altium/a0412235; CompType: IC; U/M: EA; DatasheetVersion: SLAS590I; PackageVersion: 4204106/F; PackageReference: RGC0064B; PackageDescription: 64-Pin Plastic Flat Pack, Body 9 x 9 mm, Pitch 0.5 mm; Supplier 1: Digi-Key; Supplier Part Number 1: 296-27305-2-ND; Supplier 2: Digi-Key; Supplier Part Number 2: 296-27305-1-ND; Supplier 3: Digi-Key; Supplier Part Number 3: 296-27305-6-ND; Supplier 4: Newark; Supplier Part Number 4: 74R6473; Supplier 5: Mouser; Supplier Part Number 5: 595-MSP430F5527IPNR; Comparators: Yes; Real-Time Clock: Yes; SVS: Yes; Temp Sensor: Yes; USCI_B (I2C & SPI): 2; Watchdog: Yes; SymbolVersion: 2013-07-26; PartNumber: MSP430F5528IRGC; MountType: SMT; ComponentLink1Description: Datasheet Link; ComponentLink1URL: http://www.ti.com/lit/ds/symlink/msp430f5528.pdf; RoHS: Y; Publisher: Texas Instruments; LatestRevisionDate: 2014-03-28
Y1 = ABM8-24.000MHZ-B2-T: Crystal, 24.000MHz, 18pF, SMD; Manufacturer: Abracon Corportation; SymbolCreator: a0412235; U/M: EA; TaMin_C: -20; TaMax_C: 70; Frequency Stability: ?0ppm; SymbolVersion: 2011-08-23; PartNumber: ABM8-24.000MHZ-B2-T; CompType: Crystal; PackageReference: 3.2x0.8x2.5mm; MountType: SMT; RoHS: Y; ComponentLink1Description: Datasheet Link; ComponentLink1URL: http://www.abracon.com/Resonators/abm8.pdf; Publisher: Texas Instruments; LatestRevisionDate: 2014-09-22; Supplier 1: Digi-Key; Supplier Part Number 1: 535-9138-1-ND; Supplier 2: Mouser; Supplier Part Number 2: 815-ABM8-24-B2-T
Y2 = 625L3C040M00000: OSC, 40 MHz, 3.3 V, SMD; Manufacturer: CTS Electrocomponents; SymbolCreator: a0411947; CompType: Oscillator; U/M: EA; TaMin_C: -20; TaMax_C: 70; Frequency Stability: ?0ppm; SymbolVersion: 2013-04-01; PartNumber: 625L3C040M00000; PackageReference: 2.5x1x2.5mm; MountType: SMT; RoHS: Y; ComponentLink1Description: Datasheet Link; ComponentLink1URL: http://www.ctscorp.com/components/Datasheets/008-0329-0.pdf; Publisher: Texas Instruments; LatestRevisionDate: 2015-02-04; Supplier 1: Digi-Key; Supplier Part Number 1: CTX815CT-ND; Supplier 2: Mouser; Supplier Part Number 2: 774-625L3C040M00000